# Altium schematic sheet BarridoTemp.SchDoc
size Letter
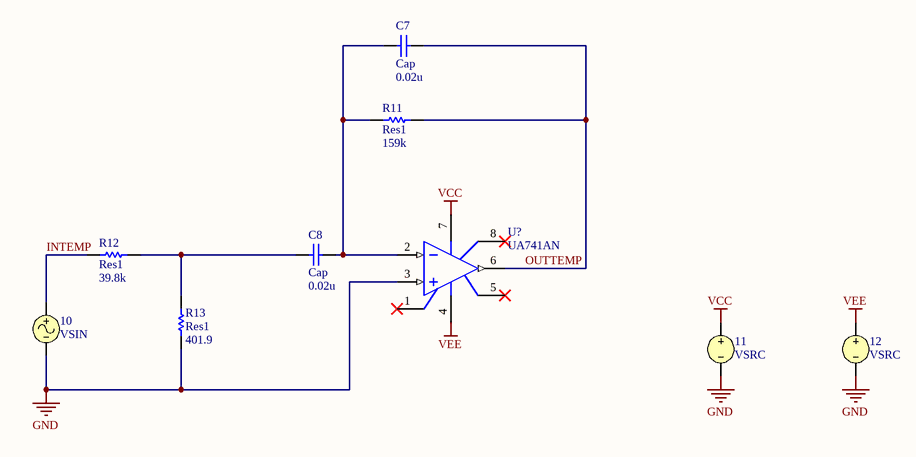
[diagram p0: BarridoTemp.SchDoc]

## Parts
10  VSIN
11  VSRC
12  VSRC
C7  Cap  value 0.02u  [RAD-0.3]
C8  Cap  value 0.02u  [RAD-0.3]
R11  Res1  value 159k  [AXIAL-0.3]
R12  Res1  value 39.8k  [AXIAL-0.3]
R13  Res1  value 401.9  [AXIAL-0.3]
U?  UA741AN  [DIP8]

## Nets
GND: 10.2 11.2 12.2 R13.2 U?.3(IN+)
VCC: 11.1 U?.7(V+)
VEE: 12.1 U?.4(V-)
INTEMP: 10.1 R12.1
OUTTEMP: C7.2 R11.2 U?.6(OUT)
NetC7_1: C7.1 C8.2 R11.1 U?.2(IN-)
NetC8_1: C8.1 R12.2 R13.1

Not connected (* = marked no-connect by the designer): U? 1(OS_NULL)* 5(OS_NULL)* 8(NC)*

## Notes on the sheet
- Project:
- Page content:
- Size:
- Revisión
- Letter
- Document Number
- Design:
- Date:
- Sheet:
- of

## Library data of the parts
10 = VSIN: Sinusoidal Voltage Source; Note: PCB Footprint - Not required; Published: 8-Jun-2000; LatestRevisionDate: 15-Nov-2004; LatestRevisionNote: Corrected Netlist.; PackageReference: Not Applicable; Publisher: Altium Limited
11 = VSRC: Voltage Source; Note: PCB Footprint - Not required; Value: +12; Published: 8-Jun-2000; LatestRevisionDate: 17-Jul-2002; LatestRevisionNote: Re-released for DXP Platform.; PackageReference: Not Applicable; Publisher: Altium Limited
12 = VSRC: Voltage Source; Note: PCB Footprint - Not required; Value: -12; Published: 8-Jun-2000; LatestRevisionDate: 17-Jul-2002; LatestRevisionNote: Re-released for DXP Platform.; PackageReference: Not Applicable; Publisher: Altium Limited
C7 C8 = Cap: Capacitor; Published: 8-Jun-2000; LatestRevisionDate: 17-Jul-2002; LatestRevisionNote: Re-released for DXP Platform.; PackageReference: RAD-0.3; Publisher: Altium Limited; PackageDescription: Radial Cap, Thru-Hole; 2 Leads; 0.3 in Pin Spacing
R11-R13 = Res1: Resistor; Published: 8-Jun-2000; LatestRevisionDate: 17-Jul-2002; LatestRevisionNote: Re-released for DXP Platform.; PackageReference: AXIAL-0.3; Publisher: Altium Limited; PackageDescription: Axial Device, Thru-Hole; 2 Leads; 0.3 in Pin Spacing
U? = UA741AN: General-Purpose Single Operational Amplifier; Published: 24-Aug-2001; LatestRevisionDate: 06-Jun-2005; LatestRevisionNote: Stylized 3D Model Added.; DatasheetVersion: Oct-1997; PackageReference: DIP8; Publisher: Altium Limited; PackageDescription: DIP; 8 Leads; Row Spacing 7.62 mm; Pitch 2.54 mm; Code_JEDEC: MO-001-AN; ComponentLink1Description: Manufacturer Link; ComponentLink1URL: http://www.st.com/; ComponentLink2Description: Datasheet; ComponentLink2URL: http://www.st.com/stonline/products/literature/ds/5304/ua741.pdf